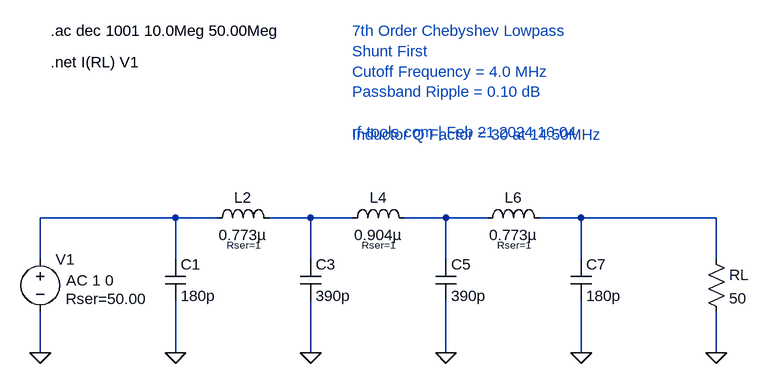
[diagram p0: schematic 14M.asc]
14M.asc, the LTspice schematic file:
Version 4
SHEET 1 1200 400
WIRE 208 0 0 0
WIRE 272 0 208 0
WIRE 416 0 352 0
WIRE 480 0 416 0
WIRE 624 0 560 0
WIRE 688 0 624 0
WIRE 832 0 768 0
WIRE 1040 0 832 0
WIRE 0 64 0 0
WIRE 208 64 208 0
WIRE 416 64 416 0
WIRE 624 64 624 0
WIRE 832 64 832 0
WIRE 1040 64 1040 0
WIRE 0 208 0 144
WIRE 208 208 208 128
WIRE 416 208 416 128
WIRE 624 208 624 128
WIRE 832 208 832 128
WIRE 1040 208 1040 144
FLAG 0 208 0
FLAG 208 208 0
FLAG 416 208 0
FLAG 624 208 0
FLAG 832 208 0
FLAG 1040 208 0
SYMBOL voltage 0 48 R0
WINDOW 123 40 48 Left 2
WINDOW 39 39 77 Left 2
SYMATTR Value2 AC 1 0
SYMATTR SpiceLine Rser=50.00
SYMATTR InstName V1
SYMATTR Value ""
SYMBOL cap 192 64 R0
SYMATTR InstName C1
SYMATTR Value 180p
SYMBOL ind 256 16 R270
WINDOW 0 32 56 VTop 2
WINDOW 3 5 56 VBottom 2
WINDOW 39 -36 57 VTop 1
SYMATTR InstName L2
SYMATTR Value 0.773µ
SYMATTR SpiceLine Rser=1
SYMBOL cap 400 64 R0
SYMATTR InstName C3
SYMATTR Value 390p
SYMBOL ind 464 16 R270
WINDOW 0 32 56 VTop 2
WINDOW 3 5 56 VBottom 2
WINDOW 39 -36 57 VTop 1
SYMATTR InstName L4
SYMATTR Value 0.904µ
SYMATTR SpiceLine Rser=1
SYMBOL cap 608 64 R0
SYMATTR InstName C5
SYMATTR Value 390p
SYMBOL ind 672 16 R270
WINDOW 0 32 56 VTop 2
WINDOW 3 5 56 VBottom 2
WINDOW 39 -36 57 VTop 1
SYMATTR InstName L6
SYMATTR Value 0.773µ
SYMATTR SpiceLine Rser=1
SYMBOL cap 816 64 R0
SYMATTR InstName C7
SYMATTR Value 180p
SYMBOL res 1024 48 R0
SYMATTR InstName RL
SYMATTR Value 50
TEXT 16 -288 Left 2 !.ac dec 1001 10.0Meg 50.00Meg
TEXT 16 -240 Left 2 !.net I(RL) V1
TEXT 480 -288 Left 2 ;7th Order Chebyshev Lowpass\nShunt First\nCutoff Frequency = 4.0 MHz\nPassband Ripple = 0.10 dB\n\nrf-tools.com | Feb 21 2024 16:04
TEXT 480 -128 Left 2 ;Inductor Q Factor = 30 at 14.50MHz

The netlist it stands for:
* 14M.asc
V1 N001 0 AC 1 0 Rser=50.00
C1 N001 0 180p
L2 N001 N002 0.773µ Rser=1
C3 N002 0 390p
L4 N002 N003 0.904µ Rser=1
C5 N003 0 390p
L6 N003 N004 0.773µ Rser=1
C7 N004 0 180p
RL N004 0 50
.ac dec 1001 10.0Meg 50.00Meg
.net I(RL) V1
* 7th Order Chebyshev Lowpass
* Shunt First
* Cutoff Frequency = 4.0 MHz
* Passband Ripple = 0.10 dB
* rf-tools.com | Feb 21 2024 16:04
* Inductor Q Factor = 30 at 14.50MHz
.backanno
.end